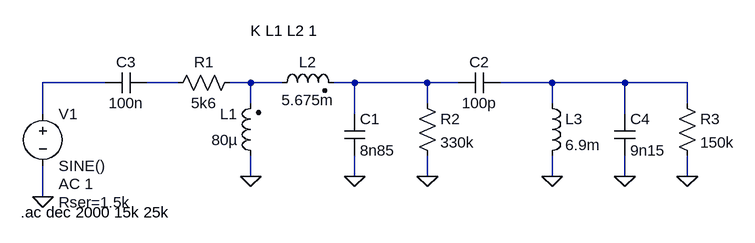
[diagram p0: schematic IF_Filter.asc]
IF_Filter.asc, the LTspice schematic file:
Version 4
SHEET 1 880 680
WIRE -112 112 -208 112
WIRE 0 112 -48 112
WIRE 112 112 80 112
WIRE 160 112 112 112
WIRE 272 112 240 112
WIRE 384 112 272 112
WIRE 432 112 384 112
WIRE 576 112 496 112
WIRE 688 112 576 112
WIRE 784 112 688 112
WIRE 112 144 112 112
WIRE 384 144 384 112
WIRE 576 144 576 112
WIRE 784 144 784 112
WIRE -208 160 -208 112
WIRE 272 160 272 112
WIRE 688 160 688 112
WIRE 112 256 112 224
WIRE 272 256 272 224
WIRE 384 256 384 224
WIRE 576 256 576 224
WIRE 688 256 688 224
WIRE 784 256 784 224
WIRE -208 288 -208 240
FLAG 112 256 0
FLAG 272 256 0
FLAG 384 256 0
FLAG 576 256 0
FLAG 688 256 0
FLAG 784 256 0
FLAG -208 288 0
SYMBOL ind2 128 240 R180
WINDOW 0 36 80 Left 2
WINDOW 3 36 40 Left 2
SYMATTR InstName L1
SYMATTR Value 80µ
SYMATTR Type ind
SYMBOL ind2 144 128 R270
WINDOW 0 32 56 VTop 2
WINDOW 3 5 56 VBottom 2
SYMATTR InstName L2
SYMATTR Value 5.675m
SYMATTR Type ind
SYMBOL res 96 96 R90
WINDOW 0 0 56 VBottom 2
WINDOW 3 32 56 VTop 2
SYMATTR InstName R1
SYMATTR Value 5k6
SYMBOL cap 256 160 R0
SYMATTR InstName C1
SYMATTR Value 8n85
SYMBOL res 368 128 R0
SYMATTR InstName R2
SYMATTR Value 330k
SYMBOL cap 496 96 R90
WINDOW 0 0 32 VBottom 2
WINDOW 3 32 32 VTop 2
SYMATTR InstName C2
SYMATTR Value 100p
SYMBOL cap -48 96 R90
WINDOW 0 0 32 VBottom 2
WINDOW 3 32 32 VTop 2
SYMATTR InstName C3
SYMATTR Value 100n
SYMBOL ind 560 128 R0
SYMATTR InstName L3
SYMATTR Value 6.9m
SYMBOL cap 672 160 R0
SYMATTR InstName C4
SYMATTR Value 9n15
SYMBOL res 768 128 R0
SYMATTR InstName R3
SYMATTR Value 150k
SYMBOL voltage -208 144 R0
WINDOW 123 24 124 Left 2
WINDOW 39 24 152 Left 2
SYMATTR InstName V1
SYMATTR Value SINE()
SYMATTR Value2 AC 1
SYMATTR SpiceLine Rser=1.5k
TEXT 112 32 Left 2 !K L1 L2 1
TEXT -242 312 Left 2 !.ac dec 2000 15k 25k

The netlist it stands for:
* IF_Filter.asc
L1 0 N003 80µ
L2 N003 N004 5.675m
R1 N003 N002 5k6
C1 N004 0 8n85
R2 N004 0 330k
C2 N005 N004 100p
C3 N002 N001 100n
L3 N005 0 6.9m
C4 N005 0 9n15
R3 N005 0 150k
V1 N001 0 SINE() AC 1 Rser=1.5k
K L1 L2 1
.ac dec 2000 15k 25k
.backanno
.end